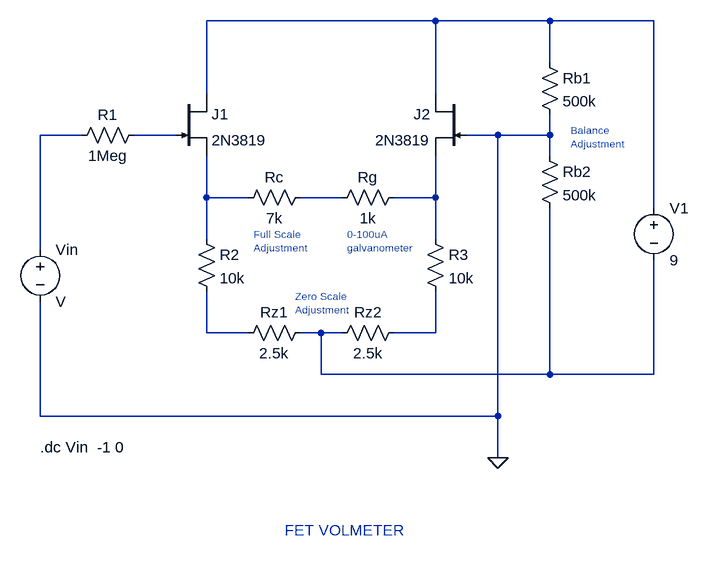
[diagram p0: schematic FET VOLMETER.asc]
FET VOLMETER.asc, the LTspice schematic file:
Version 4
SHEET 1 892 768
WIRE 496 -32 144 -32
WIRE 672 -32 496 -32
WIRE 832 -32 672 -32
WIRE 672 32 672 -32
WIRE 144 80 144 -32
WIRE 496 80 496 -32
WIRE -48 144 -112 144
WIRE 96 144 32 144
WIRE 592 144 544 144
WIRE 672 144 672 112
WIRE 672 144 592 144
WIRE 672 176 672 144
WIRE 144 240 144 176
WIRE 208 240 144 240
WIRE 352 240 288 240
WIRE 496 240 496 176
WIRE 496 240 432 240
WIRE 832 256 832 -32
WIRE 144 304 144 240
WIRE 496 304 496 240
WIRE -112 320 -112 144
WIRE 144 448 144 384
WIRE 208 448 144 448
WIRE 320 448 288 448
WIRE 352 448 320 448
WIRE 496 448 496 384
WIRE 496 448 432 448
WIRE 320 512 320 448
WIRE 672 512 672 256
WIRE 672 512 320 512
WIRE 832 512 832 336
WIRE 832 512 672 512
WIRE -112 576 -112 400
WIRE 592 576 592 144
WIRE 592 576 -112 576
WIRE 592 640 592 576
FLAG 592 640 0
SYMBOL njf 96 80 R0
SYMATTR InstName J1
SYMATTR Value 2N3819
SYMBOL res 304 224 R90
WINDOW 0 0 56 VBottom 2
WINDOW 3 32 56 VTop 2
SYMATTR InstName Rc
SYMATTR Value 7k
SYMBOL res 448 224 R90
WINDOW 0 0 56 VBottom 2
WINDOW 3 32 56 VTop 2
SYMATTR InstName Rg
SYMATTR Value 1k
SYMBOL res 128 288 R0
SYMATTR InstName R2
SYMATTR Value 10k
SYMBOL njf 544 80 M0
SYMATTR InstName J2
SYMATTR Value 2N3819
SYMBOL res 480 288 R0
SYMATTR InstName R3
SYMATTR Value 10k
SYMBOL res 304 432 R90
WINDOW 0 0 56 VBottom 2
WINDOW 3 32 56 VTop 2
SYMATTR InstName Rz1
SYMATTR Value 2.5k
SYMBOL res 448 432 R90
WINDOW 0 0 56 VBottom 2
WINDOW 3 32 56 VTop 2
SYMATTR InstName Rz2
SYMATTR Value 2.5k
SYMBOL res 656 16 R0
SYMATTR InstName Rb1
SYMATTR Value 500k
SYMBOL res 656 160 R0
SYMATTR InstName Rb2
SYMATTR Value 500k
SYMBOL voltage 832 240 R0
SYMATTR InstName V1
SYMATTR Value 9
SYMBOL res 48 128 R90
WINDOW 0 0 56 VBottom 2
WINDOW 3 32 56 VTop 2
SYMATTR InstName R1
SYMATTR Value 1Meg
SYMBOL voltage -112 304 R0
SYMATTR InstName Vin
TEXT -112 624 Left 2 !.dc Vin  -1 0
TEXT 360 296 Left 1 ;0-100uA\ngalvanometer
TEXT 216 296 Left 1 ;Full Scale\nAdjustment
TEXT 280 392 Left 1 ;Zero Scale\nAdjustment
TEXT 704 136 Left 1 ;Balance\nAdjustment
TEXT 264 752 Left 2 ;FET VOLMETER

The netlist it stands for:
* FET VOLMETER.asc
J1 N001 N003 N004 2N3819
Rc N005 N004 7k
Rg N006 N005 1k
R2 N004 N007 10k
J2 N001 0 N006 2N3819
R3 N006 N009 10k
Rz1 N008 N007 2.5k
Rz2 N009 N008 2.5k
Rb1 N001 0 500k
Rb2 0 N008 500k
V1 N001 N008 9
R1 N003 N002 1Meg
Vin N002 0 V
.model NJF NJF
.model PJF PJF
.lib standard.jft
.dc Vin  -1 0
* 0-100uA
* galvanometer
* Full Scale
* Adjustment
* Zero Scale
* Adjustment
* Balance
* Adjustment
* FET VOLMETER
.backanno
.end